# Altium project D5035-05.PrjPcb
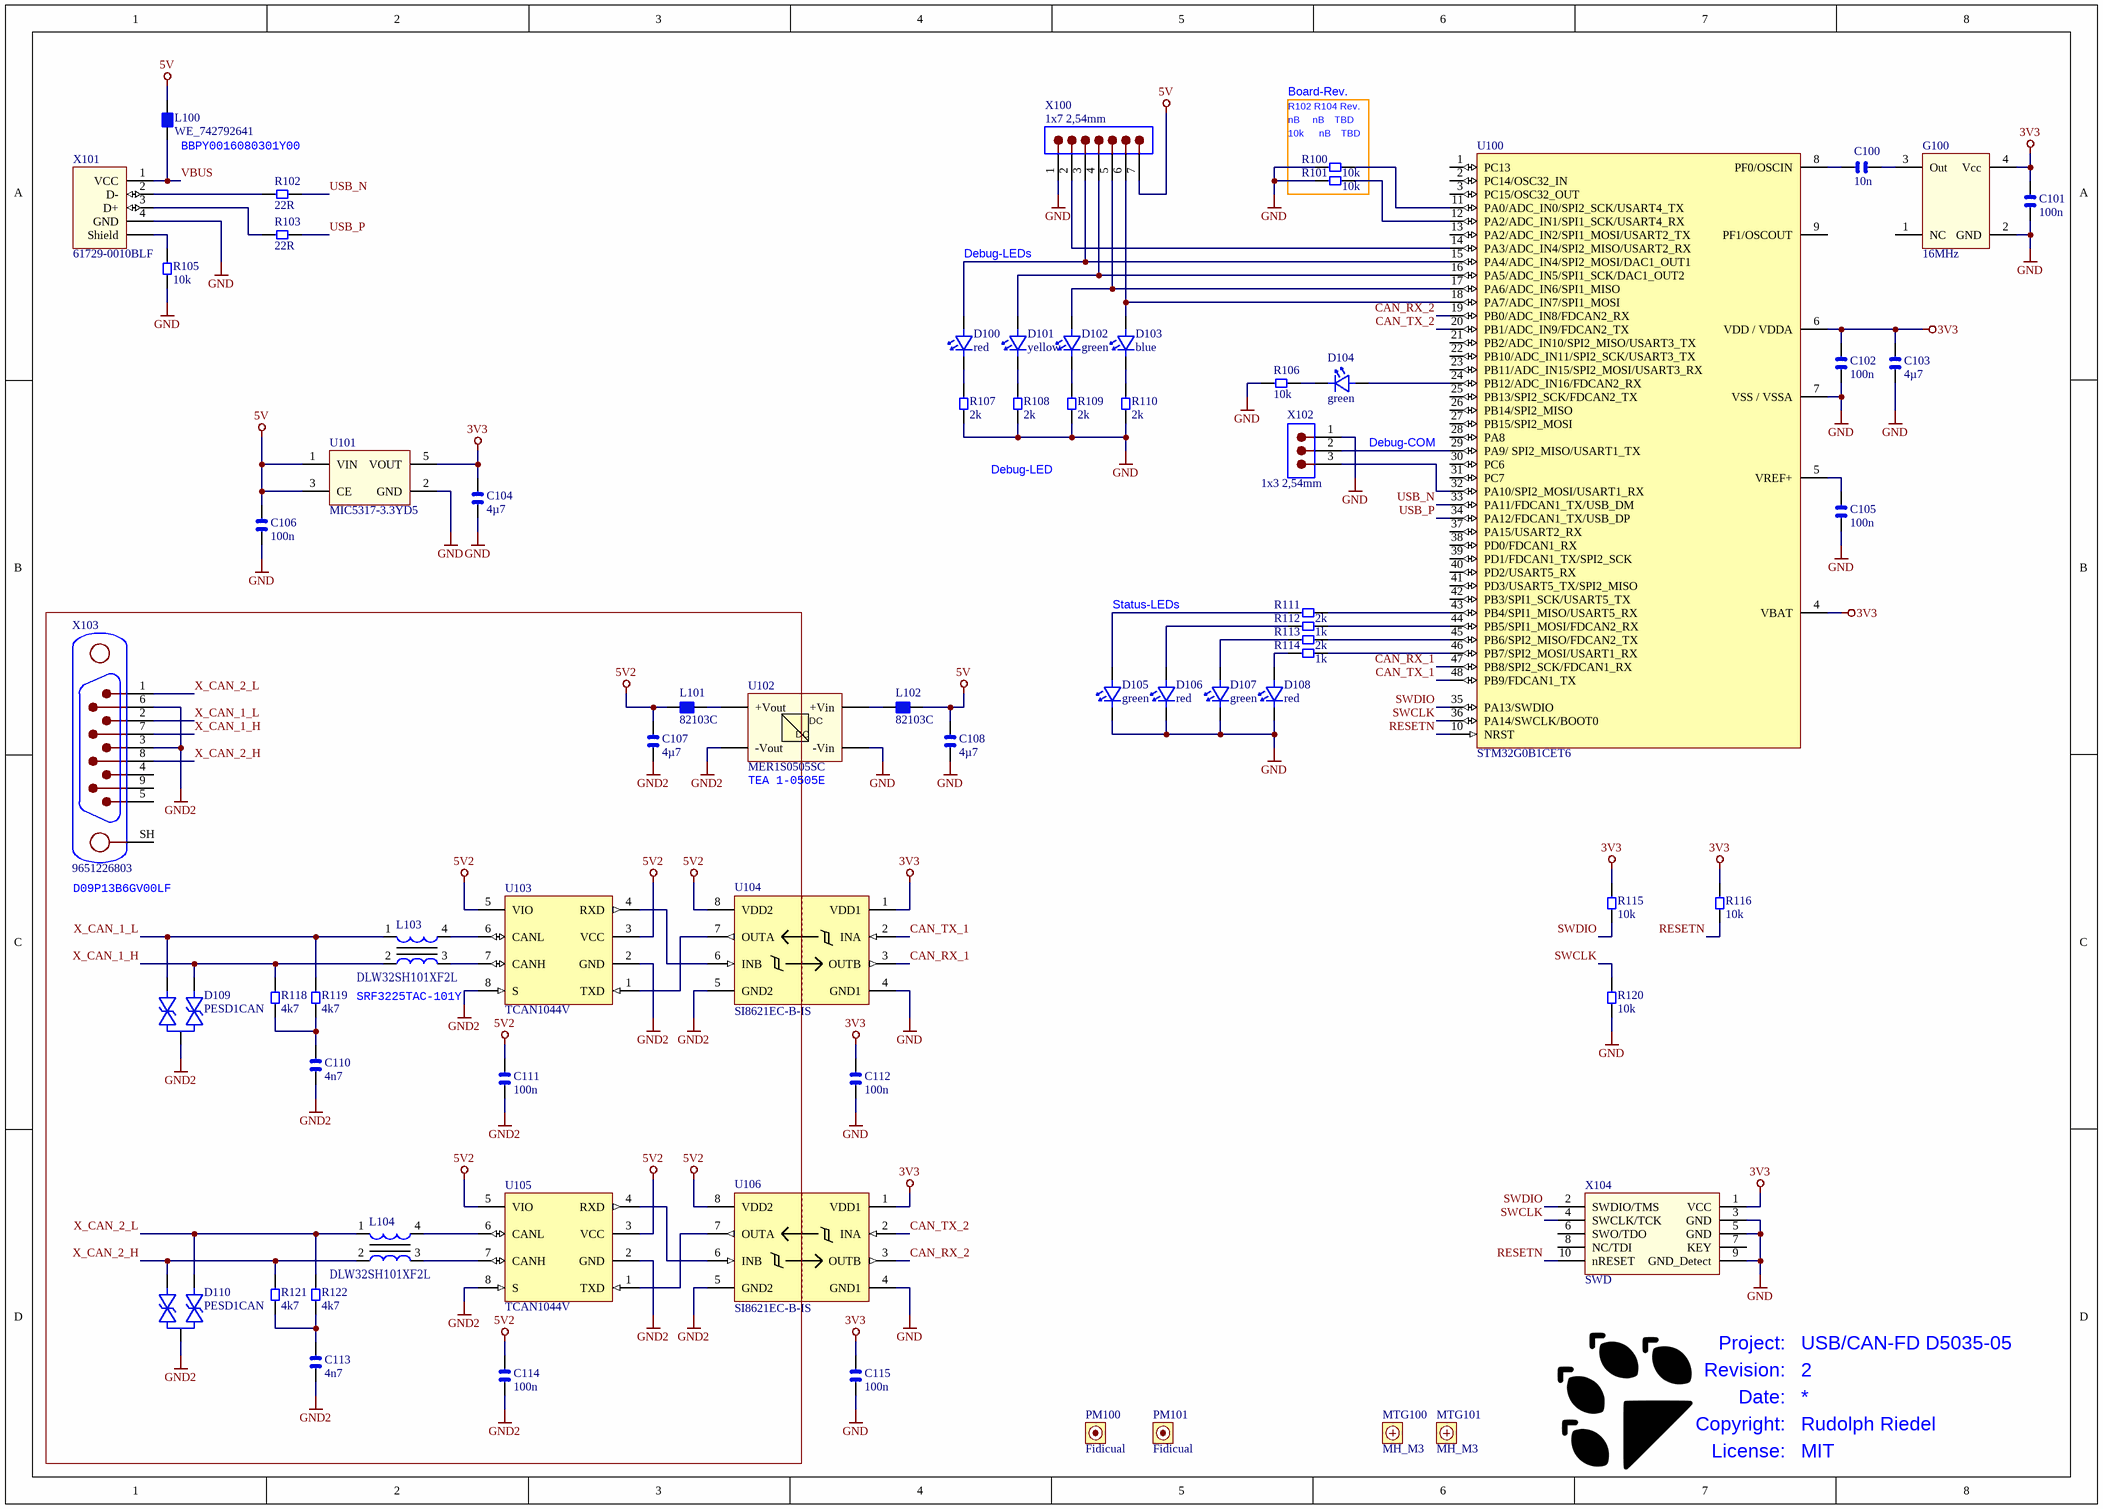
[diagram p0: D5035-05.SchDoc]
1 sheet, 69 parts. Net scope: global (net labels, ports and power ports of the same name join across sheets).
Board file: D5035_05.PcbDoc

## Sheet D5035-05.SchDoc: USB/CAN-FD D5035-05
size A3; Organization: Organization; Address1: Address1; Address2: Address2; Address3: Address3; Address4: Address4; DocumentNumber: 1; Revision: 2; SheetNumber: 1; SheetTotal: 1; PageSetup: Record=PageOptions|CenterHorizontal=True|CenterVertical=True|PrintScale=1.00|XCorrection=1.00|YCorrection=1.00|PrintKind=1|BorderSize=5000000|LeftOffset=0|BottomOffset=0|Orientation=2|PaperLength=1000|PaperWidth=1000|Scale=100|PaperSource=7|PrintQuality=-4|MediaType=1|DitherType=10|PaperKind=A3|PrintScaleMode=0

### Parts
C100  10n  [CAPC1608X09L]
C101  100n  [CAPC1608X09L]
C102  100n  [CAPC1608X09L]
C103  4µ7  [CAPC2012X14L]
C104  4µ7  [CAPC2012X14L]
C105  100n  [CAPC1608X09L]
C106  100n  [CAPC1608X09L]
C107  4µ7  [CAPC2012X14L]
C108  4µ7  [CAPC2012X14L]
C110  4n7  [CAPC2012X14L]
C111  100n  [CAPC1608X09L]
C112  100n  [CAPC1608X09L]
C113  4n7  [CAPC2012X14L]
C114  100n  [CAPC1608X09L]
C115  100n  [CAPC1608X09L]
D100  red  [DIOC1608X06N_LED]
D101  yellow  [DIOC1608X06N_LED]
D102  green  [DIOC1608X06N_LED]
D103  blue  [DIOC1608X06N_LED]
D104  green  [DIOC1608X06N_LED]
D105  green  [DIOC1608X06N_LED]
D106  red  [DIOC1608X06N_LED]
D107  green  [DIOC1608X06N_LED]
D108  red  [DIOC1608X06N_LED]
D109  PESD1CAN  [SOT95P280X110-3N]
D110  PESD1CAN  [SOT95P280X110-3N]
G100  16MHz  [TG2520]
L100  WE_742792641  [INDC1608X06L]
L101  82103C  [Murata_8200C]
L102  82103C  [Murata_8200C]
L103  DLW32SH101XF2L‎  [ACT1210]
L104  DLW32SH101XF2L‎  [ACT1210]
MTG100  MH_M3  [HOLE_3_2MM]  (no BOM)
MTG101  MH_M3  [HOLE_3_2MM]  (no BOM)
PM100  Fidicual  [PM100]  (no BOM)
PM101  Fidicual  [PM100]  (no BOM)
R100  10k  [RESC1608X06L]
R101  10k  [RESC1608X06L]
R102  22R  [RESC1608X06L]
R103  22R  [RESC1608X06L]
R105  10k  [RESC1608X06L]
R106  10k  [RESC1608X06L]
R107  2k  [RESC1608X06L]
R108  2k  [RESC1608X06L]
R109  2k  [RESC1608X06L]
R110  2k  [RESC1608X06L]
R111  2k  [RESC1608X06L]
R112  1k  [RESC1608X06L]
R113  2k  [RESC1608X06L]
R114  1k  [RESC1608X06L]
R115  10k  [RESC1608X06L]
R116  10k  [RESC1608X06L]
R118  4k7  [RESC2012X06L]
R119  4k7  [RESC2012X06L]
R120  10k  [RESC1608X06L]
R121  4k7  [RESC2012X06L]
R122  4k7  [RESC2012X06L]
U100  STM32G0B1CET6  [TQFP50P900X900X120-48N]
U101  MIC5317-3.3YD5  [SOT95P280X110-5N]
U102  MER1S0505SC  [MER1SxxxxC]
U103  TCAN1044V  [SOT65P280X100-8N]
U104  SI8621EC-B-IS  [SOIC127P600X175-8N]
U105  TCAN1044V  [SOT65P280X100-8N]
U106  SI8621EC-B-IS  [SOIC127P600X175-8N]
X100  1x7 2,54mm  [PINH_1x07_2_54mm]
X101  61729-0010BLF  [61729-xxxxxLF]
X102  1x3 2,54mm  [PINH_1x03_2_54mm]
X103  9651226803  [09651226803]
X104  SWD  [FTSH-105-01-L-DV-K]

### Blocks framed on the sheet
Board-Rev.: R100 R101

### Nets
3V3: C101.2 C102.2 C103.2 C104.2 C112.2 C115.2 G100.4(Vcc) R115.2 R116.2 U100.4(VBAT) U100.6(VDD_/_VDDA) U101.5(VOUT) U104.1(VDD1) U106.1(VDD1) X104.1(VCC)
5V: C106.2 C108.2 L100.2 L102.1 U101.1(VIN) U101.3(CE) X100.7
5V2: C107.2 C111.2 C114.2 L101.2 U103.3(VCC) U103.5(VIO) U104.8(VDD2) U105.3(VCC) U105.5(VIO) U106.8(VDD2)
GND: C101.1 C102.1 C103.1 C104.1 C105.1 C106.1 C108.1 C112.1 C115.1 D105.1 D106.1 D107.1 D108.1 G100.2(GND) R100.2 R101.2 R105.1 R106.1 R107.1 R108.1 R109.1 R110.1 R120.1 U100.7(VSS_/_VSSA) U101.2(GND) U102.2(-Vin) U104.4(GND1) U106.4(GND1) X100.1 X101.4(GND) X102.1 X104.3(GND) X104.5(GND) X104.9(GND_Detect)
GND2: C107.1 C110.1 C111.1 C113.1 C114.1 D109.3 D110.3 U102.4(-Vout) U103.2(GND) U103.8(S) U104.5(GND2) U105.2(GND) U105.8(S) U106.5(GND2) X103.3 X103.6
CAN_RX_1: U100.47(PB8/SPI2_SCK/FDCAN1_RX) U104.3(OUTB)
CAN_RX_2: U100.19(PB0/ADC_IN8/FDCAN2_RX) U106.3(OUTB)
CAN_TX_1: U100.48(PB9/FDCAN1_TX) U104.2(INA)
CAN_TX_2: U100.20(PB1/ADC_IN9/FDCAN2_TX) U106.2(INA)
RESETN: R116.1 U100.10(NRST) X104.10(nRESET)
SWCLK: R120.2 U100.36(PA14/SWCLK/BOOT0) X104.4(SWCLK/TCK)
SWDIO: R115.1 U100.35(PA13/SWDIO) X104.2(SWDIO/TMS)
USB_N: R102.2 U100.33(PA11/FDCAN1_TX/USB_DM)
USB_P: R103.2 U100.34(PA12/FDCAN1_TX/USB_DP)
VBUS: L100.1 X101.1(VCC)
X_CAN_1_H: D109.2 L103.2 R118.2 X103.7
X_CAN_1_L: D109.1 L103.1 R119.2 X103.2
X_CAN_2_H: D110.1 L104.2 R121.2 X103.8
X_CAN_2_L: D110.2 L104.1 R122.2 X103.1
NetC100_1: C100.1 U100.8(PF0/OSCIN)
NetC100_2: C100.2 G100.3(Out)
NetC105_2: C105.2 U100.5(VREF+)
NetC110_2: C110.2 R118.1 R119.1
NetC113_2: C113.2 R121.1 R122.1
NetD100_1: D100.1 R107.2
NetD100_2: D100.2 U100.15(PA4/ADC_IN4/SPI2_MOSI/DAC1_OUT1) X100.3
NetD101_1: D101.1 R108.2
NetD101_2: D101.2 U100.16(PA5/ADC_IN5/SPI1_SCK/DAC1_OUT2) X100.4
NetD102_1: D102.1 R109.2
NetD102_2: D102.2 U100.17(PA6/ADC_IN6/SPI1_MISO) X100.5
NetD103_1: D103.1 R110.2
NetD103_2: D103.2 U100.18(PA7/ADC_IN7/SPI1_MOSI) X100.6
NetD104_1: D104.1 R106.2
NetD104_2: D104.2 U100.24(PB12/ADC_IN16/FDCAN2_RX)
NetD105_2: D105.2 R111.1
NetD106_2: D106.2 R112.1
NetD107_2: D107.2 R113.1
NetD108_2: D108.2 R114.1
NetL101_1: L101.1 U102.6(+Vout)
NetL102_2: L102.2 U102.1(+Vin)
NetL103_3: L103.3 U103.7(CANH)
NetL103_4: L103.4 U103.6(CANL)
NetL104_3: L104.3 U105.7(CANH)
NetL104_4: L104.4 U105.6(CANL)
NetR100_1: R100.1 U100.11(PA0/ADC_IN0/SPI2_SCK/USART4_TX)
NetR101_1: R101.1 U100.12(PA2/ADC_IN1/SPI1_SCK/USART4_RX)
NetR102_1: R102.1 X101.2(D-)
NetR103_1: R103.1 X101.3(D+)
NetR105_2: R105.2 X101.Shell(Shield)
NetR111_2: R111.2 U100.43(PB4/SPI1_MISO/USART5_RX)
NetR112_2: R112.2 U100.44(PB5/SPI1_MOSI/FDCAN2_RX)
NetR113_2: R113.2 U100.45(PB6/SPI2_MISO/FDCAN2_TX)
NetR114_2: R114.2 U100.46(PB7/SPI2_MOSI/USART1_RX)
NetU100_14: U100.14(PA3/ADC_IN4/SPI2_MISO/USART2_RX) X100.2
NetU100_29: U100.29(PA9/_SPI2_MISO/USART1_TX) X102.2
NetU100_32: U100.32(PA10/SPI2_MOSI/USART1_RX) X102.3
NetU103_1: U103.1(TXD) U104.7(OUTA)
NetU103_4: U103.4(RXD) U104.6(INB)
NetU105_1: U105.1(TXD) U106.7(OUTA)
NetU105_4: U105.4(RXD) U106.6(INB)

Not connected (* = marked no-connect by the designer): G100 1(NC); U100 1(PC13) 2(PC14/OSC32_IN) 3(PC15/OSC32_OUT) 9(PF1/OSCOUT) 13(PA2/ADC_IN2/SPI1_MOSI/USART2_TX) 21(PB2/ADC_IN10/SPI2_MISO/USART3_TX) 22(PB10/ADC_IN11/SPI2_SCK/USART3_TX) 23(PB11/ADC_IN15/SPI2_MOSI/USART3_RX) 25(PB13/SPI2_SCK/FDCAN2_TX) 26(PB14/SPI2_MISO) 27(PB15/SPI2_MOSI) 28(PA8) 30(PC6) 31(PC7) 37(PA15/USART2_RX) 38(PD0/FDCAN1_RX) 39(PD1/FDCAN1_TX/SPI2_SCK) 40(PD2/USART5_RX) 41(PD3/USART5_TX/SPI2_MISO) 42(PB3/SPI1_SCK/USART5_TX); X103 4 5 9 SH; X104 6(SWO/TDO) 7(KEY) 8(NC/TDI)

### Notes on the sheet
- R102 R104 Rev.
- (near L100) BBPY0016080301Y00
- nB     nB    TBD
- 10k      nB    TBD
- Debug-LEDs
- Debug-COM
- Debug-LED
- Status-LEDs
- (near U102) TEA 1-0505E
- (near X103) D09P13B6GV00LF
- SRF3225TAC-101Y
- Project:
- Revision:
- Date:
- Copyright:
- License:
- Rudolph Riedel
- MIT
- (in symbol MER1S0505SC) DC

### Library data of the parts
C100-C102 C105 C106 C111 C112 C114 C115 = CAPC_0603: 0603 Chip Capacitor; Editor: rriedel; Kategorie: generic; Unterart: unpolarized; Part Number: CAPC_0603; Status: tested; Bauteilart: Capacitor; PackageDescription: 0603
  C100: Value: 10n
  C101 C102 C105 C106 C111 C112 C114 C115: Value: 100n
C103 C104 C107 C108 C110 C113 = CAPC_0805: 0805 Chip Capacitor; Editor: rriedel; Kategorie: generic; Unterart: unpolarized; Part Number: CAPC_0805; Status: tested; Bauteilart: Capacitor; PackageDescription: 0805
  C103 C104 C107 C108: Value: 4µ7
  C110 C113: Value: 4n7
D100-D108 = LED_0603: LED, 0603; Editor: rriedel; Kategorie: generic; Bauteilart: Diode; Part Number: LED_0603; Status: new; Date: 29.06.2020; Unterart: generic; PackageDescription: 0603
  D100 D106 D108: Value: red
  D101: Value: yellow
  D102 D104 D105 D107: Value: green
  D103: Value: blue
D109 D110 = PESD1CAN: CAN bus ESD protection diode; Manufacturer: Nexperia; Editor: rriedel; Kategorie: Part; Unterart: Transil; Part Number: PESD1CAN; Value: PESD1CAN; Status: new; Date: 27.06.2020; Bauteilart: Diode; PackageDescription: SOT23; Part_Number_1: PESD1CAN; Distributor_1: Digi-Key; Distributor_1_Part_Number: 1727-3817-1-ND
G100 = TG2520SMN16.0000M-MCGNNM: 16MHz Oscillator, +/- 0.5ppm; Manufacturer: Epson; Editor: rriedel; Kategorie: Part; Part Number: TG2520SMN16.0000M-MCGNNM; Value: 16MHz; Status: tested; Date: 20.11.2021; Bauteilart: Oscillator; Unterart: TG2520; PackageDescription: 2,5mm x 2,0mm; Part_Number_1: TG2520SMN16.0000M-MCGNNM; Distributor_1: Mouser; Distributor_1_Part_Number: 732-TG252S16MCGNNM3
L100 = WE_742792641: SMT EMI suppression ferrite bead WE-CBF; Manufacturer: Wuerth; Editor: rriedel; Kategorie: Part; Bauteilart: Inductor; Part Number: WE_742792641; Value: WE_742792641; Status: new; Date: 22.06.2020; Unterart: Ferrite Bead; PackageDescription: 0603; Part_Number_1: 742792641; Distributor_1: Digi-Key; Distributor_1_Part_Number: 732-1592-1-ND
L101 L102 = 82103C: 10µH, 0,5A, 400mR; Manufacturer: Murata; Editor: rriedel; Kategorie: Part; Bauteilart: Inductor; Unterart: Power; Part Number: 82103C; Value: 82103C; Status: new; Date: 27.06.2020; PackageDescription: 3,2x2,5 mm; Part_Number_1: 82103C; Distributor_1: Digi-Key; Distributor_1_Part_Number: 811-2473-1-ND
L103 L104 = ACT1210-101-2P-TL00: Common Mode Filter,  -50°C ... +150°C, AEC-Q200; Manufacturer: TDK; Editor: rriedel; Kategorie: Part; Bauteilart: Inductor; Part Number: ACT1210-101-2P-TL00; Value: DLW32SH101XF2L‎; Status: tested; Date: 17.10.2017; Unterart: Filter; PackageDescription: 3225; Part_Number_1: ACT1210-101-2P-TL00; Distributor_1: Farnell; Distributor_1_Part_Number: 2442838; Distributor_2: Digi-Key; Distributor_2_Part_Number: 445-172386-1-ND
MTG100 MTG101 = MH_M3: Mounting-Hole for M3 screws; Editor: rriedel; Kategorie: No_Bom; Bauteilart: Mechanic; Unterart: Holes; Part Number: MH_M3; Value: MH_M3; Status: tested; Date: 13.05.2018
PM100 PM101 = PM100: Passermarke für Bestueckungsautomaten 1mm rund, 2,2mm quadratischer Ausschnitt, 2,1 mm Ausstellung Loetstoplack; Editor: rriedel; Kategorie: No_Bom; Bauteilart: Manufacturing; Part Number: PM100; Value: Fidicual; Status: tested; Date: 22.02.2017; Unterart: Passermarke; PackageDescription: Passermarke 1.0mm rund
R100-R103 R105-R116 R120 = RESC_0603: 0603 Chip Resistor; Editor: rriedel; Kategorie: generic; Part Number: RESC_0603; Status: tested; Bauteilart: Resistor; Unterart: generic; PackageDescription: 0603
  R100 R101 R105 R106 R115 R116 R120: Value: 10k
  R102 R103: Value: 22R
  R107-R111 R113: Value: 2k
  R112 R114: Value: 1k
R118 R119 R121 R122 = RESC_0805: 0805 Chip Resistor; Editor: rriedel; Kategorie: generic; Part Number: RESC_0805; Value: 4k7; Status: tested; Bauteilart: Resistor; Unterart: generic; PackageDescription: 0805
U100 = STM32G0B1CET6: 32-bit Microcontroller, 64MHz Cortex M0+, 512k FLASH,  USB; Manufacturer: STM; Editor: rriedel; Kategorie: Part; Bauteilart: MikroController; Unterart: 32bit STM; Part Number: STM32G0B1CET6; Value: STM32G0B1CET6; Status: new; Date: 27.02.2023; PackageDescription: TQFP48-0.5mm; Part_Number_1: STM32G0B1CET6; Distributor_1: Mouser; Distributor_1_Part_Number: 511-STM32G0B1CET6
U101 = MIC5233-3.3: 100 mA LDO,  Vout= 3,3V, -40°C..125°C; Manufacturer: Microchip; Part_Number_1: MIC5233-3.3YM5; Editor: rriedel; Kategorie: Part; Bauteilart: IC; Unterart: Linear-Regulators; ComponenLinkDescription: Datasheet; ComponenLinkURL: D:\Altium_lib_HW-Labor_GF\Altium_lib\Datenblaetter\pcb\Integrierte Schaltkreise\Microchip\mic5233.pdf; Part Number: MIC5233-3.3; Value: MIC5317-3.3YD5; Status: tested; Date: 15.09.2016; PackageDescription: SOT23-5; Distributor_1: Farnell; Distributor_1_Part_Number: 2510274
U102 = MER1S0505SC: Isolated 1W Single Output DC-DC Converters 5V/5V 200mA; Manufacturer: Murata; Editor: rriedel; Kategorie: Part; Bauteilart: Module; Unterart: DCDC; Part Number: MER1S0505SC; Value: MER1S0505SC; Status: new; Date: 27.06.2020; PackageDescription: 4Pin SIP; Part_Number_1: MER1S0505SC; Distributor_1: Digi-Key; Distributor_1_Part_Number: 811-2124-5-ND‎
U103 U105 = TCAN1044V: CAN-FD transceiver 8MBit, VIO Pin; Manufacturer: TI; Part_Number_1: TCAN1044VDDFR; Editor: rriedel; Kategorie: Part; Bauteilart: IC; Unterart: CAN; Part Number: TCAN1044V; Value: TCAN1044V; Status: new; Date: 28.06.2020; PackageDescription: SOT23-8; Distributor_1: Digi-Key; Distributor_1_Part_Number: 296-TCAN1044VDDFRCT-ND
U104 U106 = SI8621EC-B-IS: Dual channel digital isolator, 150Mbit, 3,75kV; Manufacturer: Silicon Labs; Editor: rriedel; Kategorie: Part; Bauteilart: IC; Part Number: SI8621EC-B-IS; Value: SI8621EC-B-IS; Status: new; Date: 29.06.2020; Unterart: Isolator; PackageDescription: SO8; Part_Number_1: SI8621EC-B-IS; Distributor_1: Digi-Key; Distributor_1_Part_Number: 336-4776-1-ND
X100 = PINH_1x7_2_54: Pin-Header 2,54 mm 7pins; Editor: rriedel; Kategorie: generic; Bauteilart: Connector; Part Number: PINH_1x7_2_54; Value: 1x7 2,54mm; Status: tested; Date: 07.02.2017; Unterart: Pin-Header
X101 = 61729-0010BLF: USB-B socket, THT; Manufacturer: Amphenol; Editor: rriedel; Kategorie: Part; Bauteilart: Connector; Part Number: 61729-0010BLF; Value: 61729-0010BLF; Status: new; Date: 28.06.2020; Unterart: USB; PackageDescription: USB-B; Part_Number_1: 61729-0010BLF; Distributor_1: Digi-Key; Distributor_1_Part_Number: 609-1039-ND
X102 = PINH_1x3_2_54: Pin-Header 2,54 mm 3pins; Editor: rriedel; Kategorie: generic; Bauteilart: Connector; Part Number: PINH_1x3_2_54; Value: 1x3 2,54mm; Status: tested; Date: 02.02.2017; Unterart: Pin-Header
X103 = 9651226803: D-Sub, 9 pin, male, right angle; Manufacturer: Harting; Editor: rriedel; Kategorie: Part; Bauteilart: Connector; Part Number: 9651226803; Value: 9651226803; Status: new; Date: 29.06.2020; Unterart: D-Sub; PackageDescription: D-Sub; Part_Number_1: 9651226803; Distributor_1: Farnell; Distributor_1_Part_Number: 2752007
X104 = SWD: ARM Debug-Header 2x5 1,27 mm; Editor: rriedel; Kategorie: Part; Bauteilart: Connector; Unterart: Debug; Part Number: SWD; Value: SWD; Status: tested; Date: 12.08.2018; PackageDescription: 2x5 1,27mm

## Assembly variants
Debug: not fitted R100 R101 R104 X100
Release: not fitted D100 D101 D102 D103 R100 R101 R104 R107 R108 R109 R110 X100 X102 X104